# EasyEDA Pro project ProPrj_辉光管时钟V2.0_2025-10-09.epro, board 电源+控制
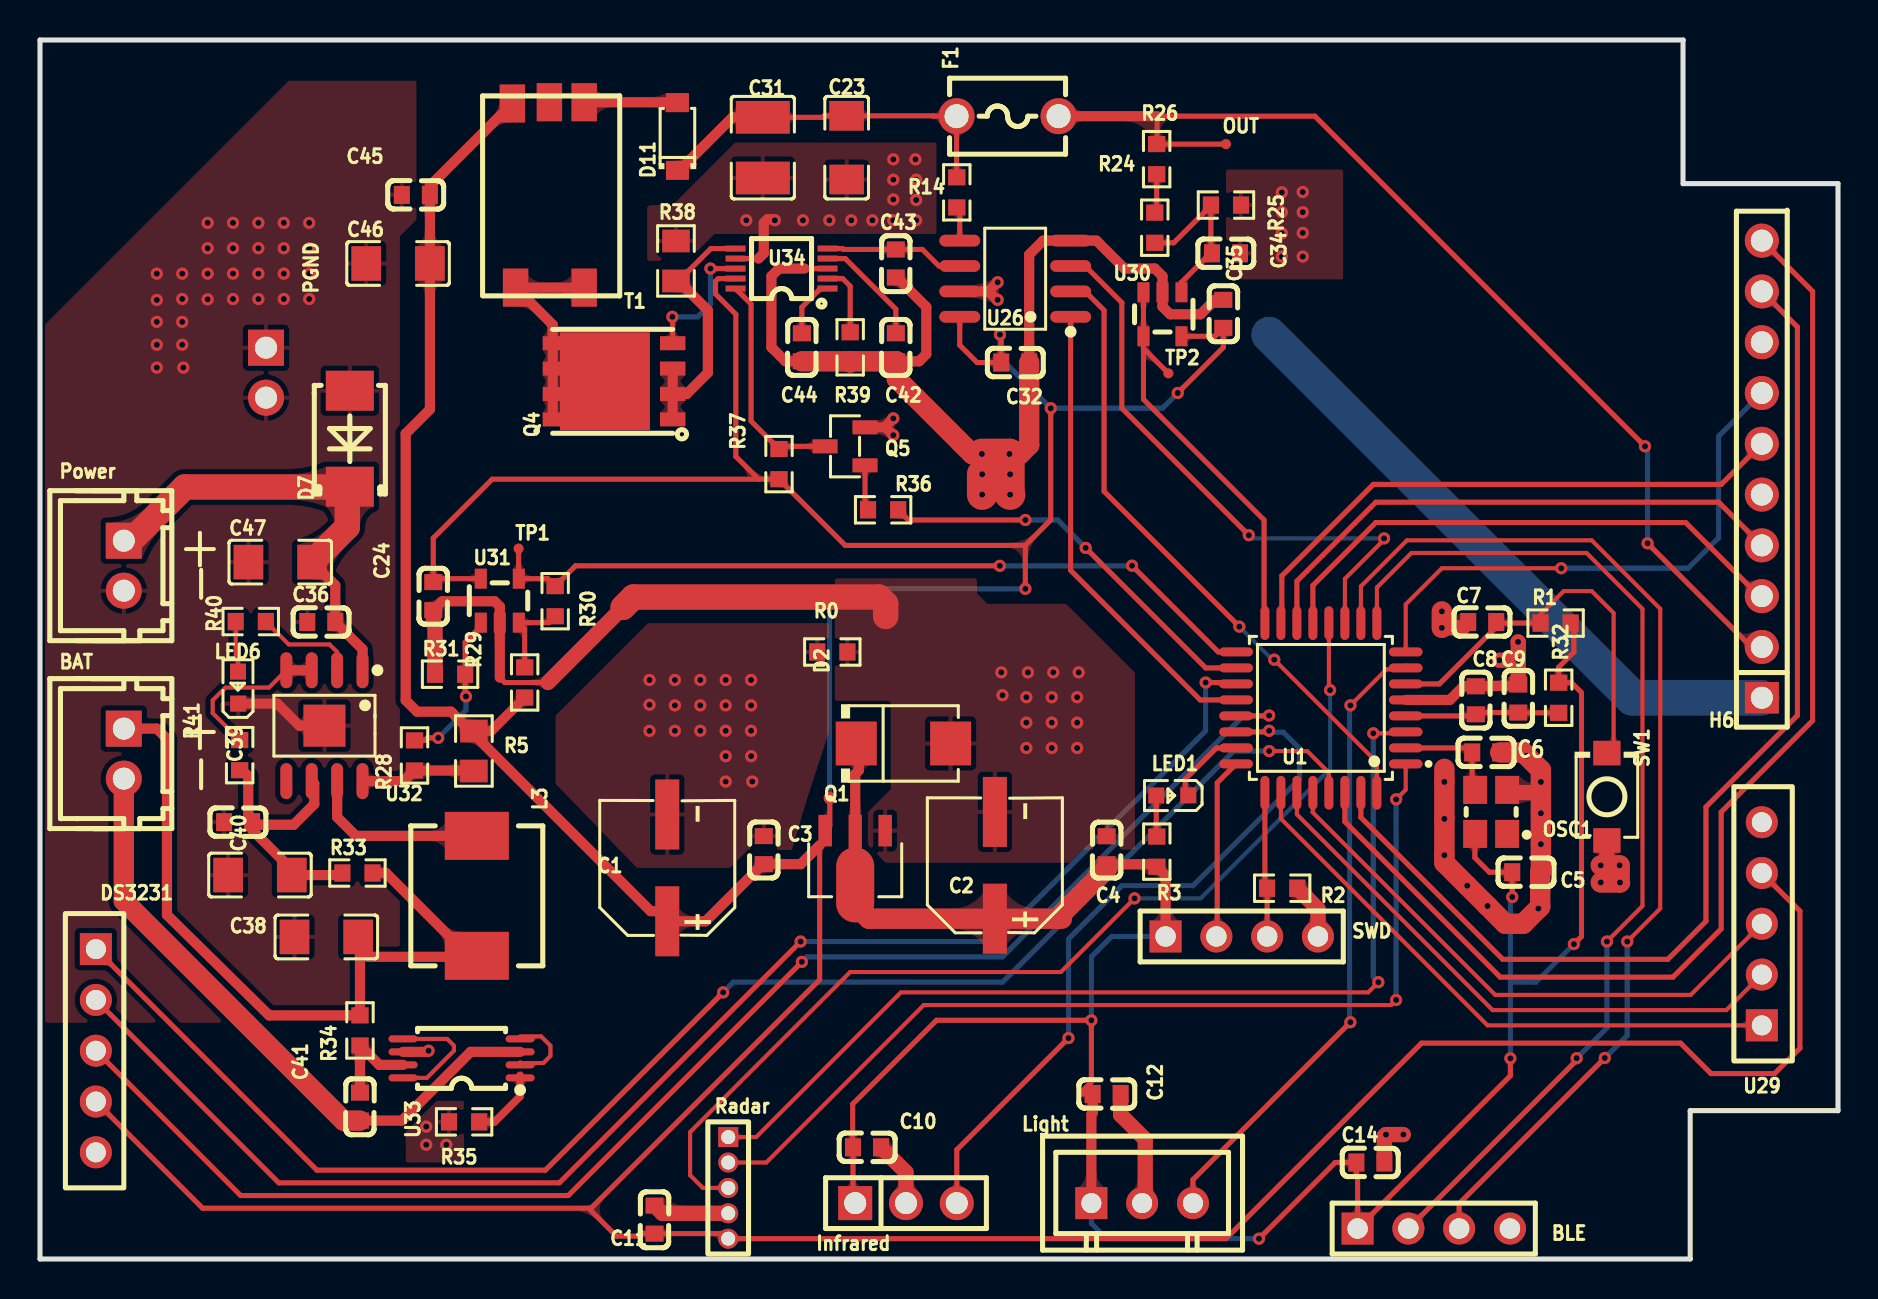
[diagram p3: board, top side]
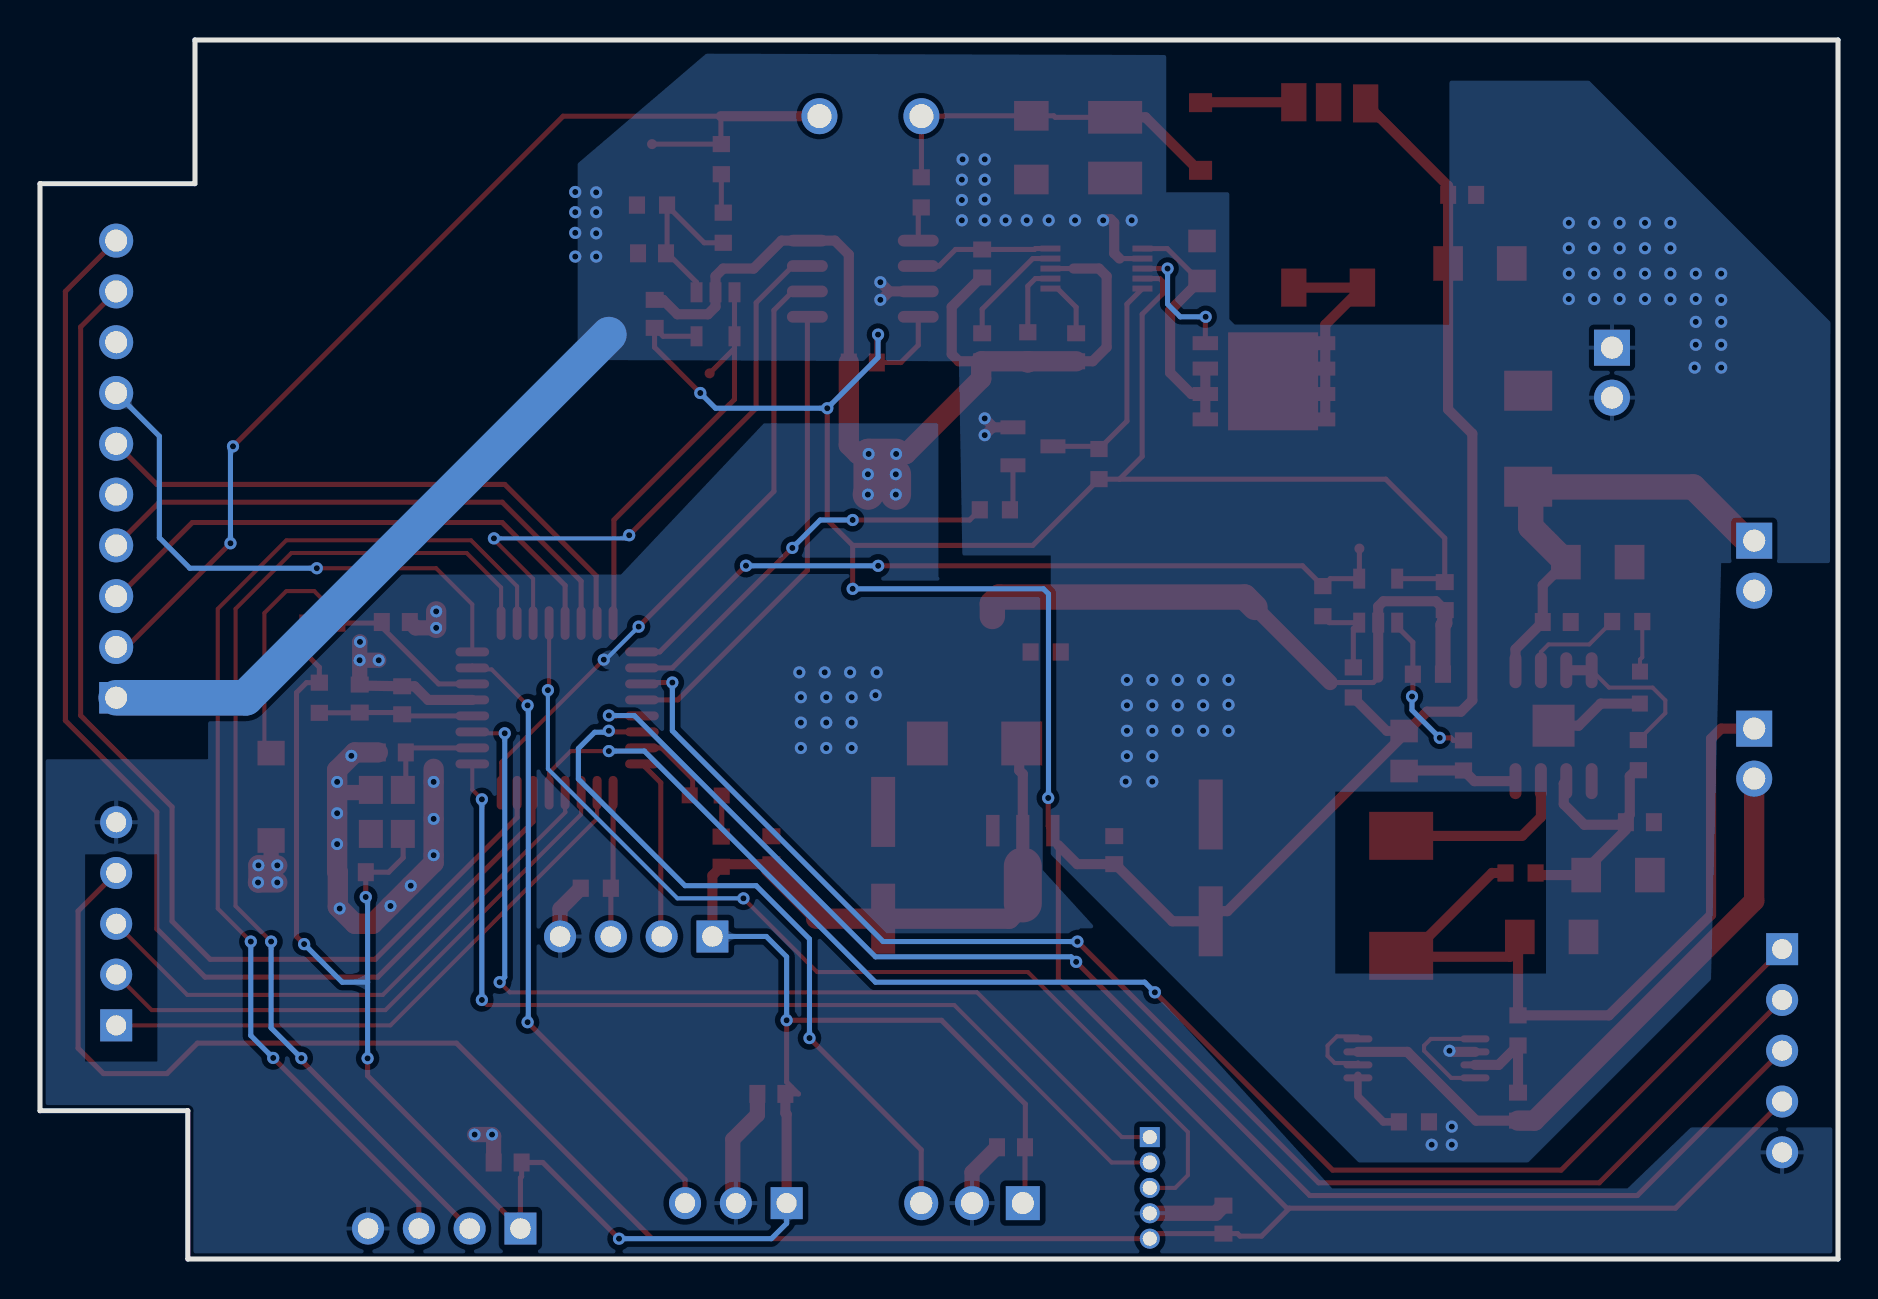
[diagram p4: board, bottom side, seen from below]

Outline 89.92 x 60.96 mm; copper layers: Top Layer, Bottom Layer. Coordinates in mm from the lower left corner of the outline.
Outline path: 0,60.96 0,0 82.52,0 82.52,7.42 89.92,7.42 89.92,53.78 82.17,53.78 82.17,60.96 0,60.96
Stack: Top Layer 0.035mm / Dielectric1 1.51mm FR4 er 4.5 / Bottom Layer 0.035mm

## Design rules (mm)
template: 自定义配置
spacing copperThickness1oz (default): track to track 0.102, other pairs 0.152 to 0.3
spacing copperThickness2oz: track to track 0.203, other pairs 0.152 to 0.3
track width copperThickness1oz (default): min 0.127, default 0.254, max 2.54
track width copperThickness2oz: min 0.203, default 0.254, max 2.54
differential pair differentialPair (default): width min 0.127, default 0.254, max 2.54; gap min 0.152, default 0.152
via viaSize (default): diameter min 0.5, default 0.61, max 10; hole min 0.3, default 0.305, max 6.3

## Placement (name value [footprint] x y rotation side)
BAT  ZX-XH2.54-2PZZ  [CONN-TH_2P-P2.50_HX25003-2A]  4.19 25.27 270 top
BLE  排针  [SIP-2.54MM-4P-CJT-H8.54]  69.7 1.52 180 top
C1  220uF  [CAP-SMD_BD6.3-L6.6-W6.6-FD]  31.37 19.56 90 top
C2  220uF  [CAP-SMD_BD6.3-L6.6-W6.6-FD]  47.75 19.69 90 top
C3  100nF  [C0603]  36.19 20.45 270 top
C4  100nF  [C0603]  53.34 20.44 270 top
C5  100nF  [C0603]  74.32 19.34 0 top
C6  15pF  [C0603]  72.32 25.33 0 top
C7  100nF  [C0603]  72.12 31.85 0 top
C8  100nF  [C0603]  71.81 27.94 270 top
C9  2.2uF  [C0603]  73.93 28.03 270 top
C10  100nF  [C0603]  41.36 5.59 180 top
C11  100nF  [C0603]  30.73 1.97 90 top
C12  100nF  [C0603]  53.34 8.26 180 top
C14  100nF  [C0603]  66.53 4.83 0 top
C23  0.1uF  [c1206]  40.34 55.58 90 top
C24  0.1u  [C0603]  19.67 33.15 90 top
C31  2.2uF  [c1210]  36.15 55.58 90 top
C32  0.1uF  [c0603]  48.77 44.83 180 top
C34  0.1u  [C0603]  59.31 50.29 0 top
C35  0.1u  [C0603]  59.18 47.27 270 top
C36  100nF  [C0603]  14.07 31.85 0 top
C38  22uF  [c1206]  14.32 16.11 0 top
C39  100nF  [C0603]  9.91 21.84 0 top
C40  22uF  [c1206]  11 19.2 0 top
C41  100nF  [C0603]  16 7.62 90 top
C42  0.22uF  [c0603]  42.8 45.59 90 top
C43  10nF  [c0603]  42.8 49.78 90 top
C44  1uF  [c0603]  38.1 45.59 90 top
C45  0.1uF  [c0603]  18.8 53.21 0 top
C46  100uF  [c1206]  17.91 49.78 0 top
C47  100uF  [c1206]  12.02 34.85 0 top
D2  SMBJ3.3A  [SMB_L4.6-W3.6-LS5.3-RD]  43.18 25.78 0 top
D7  SMBJ5.0A  [SMB_L4.4-W3.6-LS5.3-RD]  15.49 41.02 90 top
D11  ES1J  [sod-123_l2.7-w1.6-ls3.6-rd]  31.88 56.13 90 top
DS3231  -  [2.54mm1*5]  2.79 10.42 270 top
F1  JK250-080U  [FUSE-TH_L5.8-W3.8-P5.10-D0.8]  48.39 57.15 0 top
H6  MH254V-11-10-1196  [HDR-TH_10P-P2.54-V-M]  86.11 39.5 90 top
Infrared  PZ254V-11-03P  [HDR-TH_3P-P2.54-V-M]  43.31 2.79 0 top
L3  2.2uH  [IND-SMD_L7.0-W6.6]  21.84 18.16 270 top
LED1  NCD0603R1  [LED0603-RD_RED]  56.62 23.18 180 top
LED6  NCD0603R1  [LED0603-RD_RED]  9.91 28.58 90 top
Light  ZX-XH2.54-3PZZ  [CONN-TH_3P-P2.54_2501S-3P]  55.12 2.79 0 top
OSC1  8MHz  [OSC-SMD_4P-L3.2-W2.5-BL-1]  72.57 22.36 90 top
OUT  -  [Test-Point-0.5mm]  59.31 55.75 0 top
PGND  ZX-XH2.54-2PZZ  [CONN-TH_2P-P2.50_HX25003-2A]  11.3 44.32 270 top
Power  ZX-XH2.54-2PZZ  [CONN-TH_2P-P2.50_HX25003-2A]  4.19 34.67 270 top
Q1  AMS1117-3.3V  [SOT-89-3_L4.5-W2.5-P1.50-LS4.2-BR]  40.77 20.07 90 top
Q4  CSD18540Q5B  [VSON-CLIP-8_L5.0-W6.0-P1.27-BL]  28.64 43.89 90 top
Q5  MMBT5551  [SOT-23-3_L2.9-W1.3-P1.90-LS2.4-BR]  40.26 40.64 0 top
R0  0欧姆  [R0603]  39.62 30.36 0 top
R1  50kΩ  [r0603]  75.79 31.8 0 top
R2  10kΩ  [r0603]  62.12 18.54 180 top
R3  220Ω  [r0603]  55.85 20.37 90 top
R5  100mΩ  [R0805]  21.7 25.4 90 top
R14  910K  [r0603]  45.85 53.34 90 top
R24  1.8MΩ  [r0603]  55.75 51.57 90 top
R25  39kΩ  [r0603]  59.31 52.7 180 top
R26  1MΩ  [r0603]  55.84 55 90 top
R28  1KΩ  [R0603]  18.73 25.18 90 top
R29  10KΩ  [R0603]  24.24 28.83 90 top
R30  10KΩ  [R0603]  25.76 32.9 90 top
R31  30KΩ  [R0603]  20.51 29.25 0 top
R32  0Ω  [R0603]  75.95 28.07 90 top
R33  1Ω  [R0603]  15.88 19.3 0 top
R34  100Ω  [R0603]  16 11.43 90 top
R35  1K  [R0603]  21.21 6.86 0 top
R36  1kΩ  [r0603]  42.16 37.47 0 top
R37  1kΩ  [r0603]  36.96 39.75 270 top
R38  20mΩ  [R0805]  31.81 49.91 270 top
R39  175kΩ  [r0603]  40.52 45.59 270 top
R40  1KΩ  [R0603]  10.54 31.88 180 top
R41  1KΩ  [R0603]  9.98 25.2 90 top
Radar  FH1.27-01-5PZD  [HDR-TH_5P-P1.27-V-M]  34.42 3.56 270 top
SW1  TS-1088R-02026  [SW-SMD_L3.9-W3.0-P4.45]  78.36 23.11 90 top
SWD  排针  [SIP-2.54MM-4P-CJT-H8.54]  60.1 16.13 180 top
T1  -  [TTRN-060-054]  25.53 53.09 180 top
TP1  -  [Test-Point-0.5mm]  23.93 35.53 0 top
TP2  -  [Test-Point-0.5mm]  56.43 44.29 0 top
U1  STM32G070KBT6  [LQFP-32_L7.0-W7.0-P0.80-LS9.0-BL]  64.06 27.56 90 top
U26  MCP41010T-I/SN  [SOIC-8_L4.9-W3.9-P1.27-LS6.0-BL]  48.77 49.02 90 top
U29  -  [2.54mm1*5]  86.11 16.76 90 top
U30  LM321MF  [SOT-23-5_L2.9-W1.6-P0.95-LS2.8-BL]  56.13 47.24 180 top
U31  LM321MF  [SOT-23-5_L2.9-W1.6-P0.95-LS2.8-BL]  22.99 32.92 0 top
U32  IP5306-CK  [SOP-8_L4.9-W3.9-P1.27-LS6.0-BL-EP2.1]  14.22 26.67 180 top
U33  DW03D  [TSSOP-8_L4.4-W3.0-P0.65-LS6.4-BL]  21.08 10.03 90 top
U34  MAX668EUB+  [UMAX-10_L3.0-W3.0-P0.50-LS4.9-BL]  37.08 49.53 90 top

## Footprints (pads in the part's own frame, mm; a bottom-side part is the same pattern mirrored in y, then rotated)
2.54mm1*5
  rect 1.6x1.6 hole 1: 1(-5.08,0)
  round 1.6 hole 1: 2(-2.54,0) 3(0,0) 4(2.54,0) 5(5.08,0)
c0603
  rect 0.8x0.9 smd: 1(-0.7,0) 2(0.7,0)
C0603
  rect 0.8x0.9 smd: 1(-0.7,0) 2(0.7,0)
c1206
  rect 1.485x1.728 smd: 1(-1.593,0) 2(1.593,0)
c1210
  rect 1.635x2.7 smd: 1(-1.518,0) 2(1.518,0)
CAP-SMD_BD6.3-L6.6-W6.6-FD
  rect 3.5x1.2 smd: 1(-2.67,0) 2(2.67,0)
CONN-TH_2P-P2.50_HX25003-2A
  rect 1.8x1.8 hole 1.1: 1(-1.25,0)
  round 1.8 hole 1.1: 2(1.25,0)
CONN-TH_3P-P2.54_2501S-3P
  rect 1.6x1.6 hole 1: 1(-2.54,0)
  round 1.6 hole 1: 2(0,0) 3(2.54,0)
FUSE-TH_L5.8-W3.8-P5.10-D0.8
  round 1.8 hole 1.2: 1(-2.55,0) 2(2.55,0)
HDR-TH_3P-P2.54-V-M
  rect 1.7x1.7 hole 1.1: 1(-2.54,0)
  round 1.7 hole 1.1: 2(0,0) 3(2.54,0)
HDR-TH_5P-P1.27-V-M
  rect 1x1 hole 0.7: 1(-2.54,0)
  round 1 hole 0.7: 2(-1.27,0) 3(0,0) 4(1.27,0) 5(2.54,0)
HDR-TH_10P-P2.54-V-M
  rect 1.575x1.7 hole 1.1: 1(-11.43,0)
  round 1.7 hole 1.1: 2(-8.89,0) 3(-6.35,0) 4(-3.81,0) 5(-1.27,0) 6(1.27,0) 7(3.81,0) 8(6.35,0) 9(8.89,0) 10(11.43,0)
IND-SMD_L7.0-W6.6
  rect 2.4x3.2 smd: 1(-3,0) 2(3,0)
LED0603-RD_RED
  rect 0.8x0.8 smd: 1(-0.799,-0.004) 2(0.799,0.004)
LQFP-32_L7.0-W7.0-P0.80-LS9.0-BL
  oval 0.448x1.684 smd: 1(-2.8,-4.242) 2(-2,-4.242) 3(-1.2,-4.242) 4(-0.4,-4.242) 5(0.4,-4.242) 6(1.2,-4.242) 7(2,-4.242) 8(2.8,-4.242) 17(2.8,4.242) 18(2,4.242) 19(1.2,4.242) 20(0.4,4.242) 21(-0.4,4.242) 22(-1.2,4.242) 23(-2,4.242) 24(-2.8,4.242)
  oval 1.684x0.448 smd: 9(4.242,-2.8) 10(4.242,-2) 11(4.242,-1.2) 12(4.242,-0.4) 13(4.242,0.4) 14(4.242,1.2) 15(4.242,2) 16(4.242,2.8) 25(-4.242,2.8) 26(-4.242,2) 27(-4.242,1.2) 28(-4.242,0.4) 29(-4.242,-0.4) 30(-4.242,-1.2) 31(-4.242,-2) 32(-4.242,-2.8)
OSC-SMD_4P-L3.2-W2.5-BL-1
  rect 1.4x1.2 smd: 1(-1.1,-0.8) 2(1.1,-0.8) 3(1.1,0.8) 4(-1.1,0.8)
r0603
  rect 0.806x0.864 smd: 1(-0.753,0) 2(0.753,0)
R0603
  rect 0.806x0.864 smd: 1(-0.753,0) 2(0.753,0)
R0805
  rect 1.133x1.377 smd: 1(-1,0) 2(1,0)
SIP-2.54MM-4P-CJT-H8.54
  rect 1.6x1.6 hole 1.02: 1(3.81,0)
  round 1.6 hole 1.02: 2(1.27,0) 3(-1.27,0) 4(-3.81,0)
SMB_L4.4-W3.6-LS5.3-RD
  rect 2x2.4 smd: 1(-2.4,0) 2(2.4,0)
SMB_L4.6-W3.6-LS5.3-RD
  rect 2.047x2.192 smd: 1(-2.361,0) 2(2.361,0)
sod-123_l2.7-w1.6-ls3.6-rd
  rect 0.95x1.15 smd: 1(-1.692,0) 2(1.692,0)
SOIC-8_L4.9-W3.9-P1.27-LS6.0-BL
  oval 0.588x2.045 smd: 1(-1.905,-2.772) 2(-0.635,-2.772) 3(0.635,-2.772) 4(1.905,-2.772) 5(1.905,2.772) 6(0.635,2.772) 7(-0.635,2.772) 8(-1.905,2.772)
SOP-8_L4.9-W3.9-P1.27-LS6.0-BL-EP2.1
  oval 0.6x1.8 smd: 1(-1.905,-2.772) 2(-0.635,-2.772) 3(0.635,-2.772) 4(1.905,-2.772) 5(1.905,2.772) 6(0.635,2.772) 7(-0.635,2.772) 8(-1.905,2.772)
  rect 2.1x2.1 smd: 9(0,0)
SOT-23-3_L2.9-W1.3-P1.90-LS2.4-BR
  rect 1.25x0.7 smd: 1(1,-0.95) 2(1,0.95) 3(-1,0)
SOT-23-5_L2.9-W1.6-P0.95-LS2.8-BL
  rect 0.6x1 smd: 1(-0.95,-1.1) 2(0,-1.1) 3(0.95,-1.1) 4(0.95,1.1) 5(-0.95,1.1)
SOT-89-3_L4.5-W2.5-P1.50-LS4.2-BR
  rect 1.575x0.672 smd: 1(1.356,-1.5) 3(1.356,1.5)
  custom 5.377x1.9 smd: 2(-1.356,0)
SW-SMD_L3.9-W3.0-P4.45
  rect 1.23x1.36 smd: 1(-2.185,0) 2(2.185,0)
Test-Point-0.5mm
  round 0.5 smd: 1(0,0)
TSSOP-8_L4.4-W3.0-P0.65-LS6.4-BL
  oval 0.353x1.454 smd: 1(-0.975,-2.927) 2(-0.325,-2.927) 3(0.325,-2.927) 4(0.975,-2.927) 5(0.975,2.927) 6(0.325,2.927) 7(-0.325,2.927) 8(-0.975,2.927)
TTRN-060-054
  custom 1.27x1.905 smd: 1(1.905,-4.699) 2(-1.687,4.51) 3(-1.687,-4.761) 4(1.742,4.51) NC(0.051,-4.761)
UMAX-10_L3.0-W3.0-P0.50-LS4.9-BL
  rect 0.3x1 smd: 1(-0.999,-2.3) 2(-0.499,-2.3) 3(0.001,-2.3) 4(0.501,-2.3) 5(1.001,-2.3) 6(0.999,2.3) 7(0.499,2.3) 8(-0.001,2.3) 9(-0.5,2.3) 10(-1.001,2.3)
VSON-CLIP-8_L5.0-W6.0-P1.27-BL
  rect 0.7x1.27 smd: 1(-1.904,-3) 2(-0.636,-3) 3(0.636,-3) 4(1.906,-3)
  rect 0.7x1 smd: 5(1.904,3) 6(0.634,3) 7(-0.636,3) 8(-1.906,3)
  rect 4.9x4.5 smd: 8(-0.001,0.39)

## Nets
As in the schematic, except:
POWER: R36.2 U1.18

Pads without a net: H6 5 8; OSC1 1; T1 NC; U32 5

## Via types
v1: diameter 0.61, hole 0.305, Top Layer to Bottom Layer, 165 vias

## Routing (per net, layer and track width the routed paths; a pad name or vN(x,y) marks a point on that pad's centre or on a via; arc(x,y) is an arc through that point)
170V: length 53.8
  Top Layer w0.254: H6.2 85.58,30.61 v1(80.39,35.79) ; v1(80.26,40.64) 63.75,57.15 55.86,57.15 55.86,55.78 R26.2 55.85,55.75 OUT.1
  Top Layer w0.508: F1.2 55.86,57.15
  Bottom Layer w0.254: v1(80.26,40.64) 80.39,40.51 v1(80.39,35.79)
+3.3V: length 129.5
  Top Layer w0.254: Infrared.1 40.66,2.9 C10.2 40.64,5.61 40.64,7.75 44.83,11.94 v1(52.58,11.94) 52.58,8.85 51.99,8.26 C12.2 ; OSC1.4 71.75,21.24 71.75,20.07 72.48,19.34 C5.1 73.63,19.34 v1(73.63,18.1) ; v1(73.53,10.03) 73.53,9.17 BLE.1 65.89,4.06 65.83,4.12 C14.1 64.77,4.83 v1(60.96,1.02) ; R1.2 76.71,31.64 76.71,30.35 75.95,29.59 R32.2 76.59,28.82 77.09,28.32 77.09,16.13 v1(76.71,15.75)
  Top Layer w0.508: Q1.2 40.77,24.25 40.95,24.43 40.95,25.78 ; SWD.1 56.29,19.18 55.73,19.74 C4.2 ; C12.2 52.64,7.3 52.58,7.23 Light.1
  Top Layer w1.016: 40.38,18.09 41.45,17.02 C2.1 50.85,17.02 ; 50.85,17.02 53.39,19.56 ; 50.85,17.02 51.1,17.02
  Bottom Layer w0.254: Light.1 52.58,1.78 53.34,1.02 v1(60.96,1.02) ; SWD.1 53.59,16.13 52.58,15.11 v1(52.58,11.94) ; v1(73.53,10.03) 73.53,13.84 ; 73.53,13.84 74.8,13.84 v1(76.71,15.75) ; 73.53,13.84 73.53,18.01 v1(73.63,18.1)
+5V: length 291.3
  Top Layer w0.254: 59.13,46.52 59.18,46.52 59.18,45.59 v1(56.9,43.31) ; 59.13,46.52 C35.2 ; 59.13,46.52 58.76,46.14 U30.5 ; 35.93,39 R37.2 40.27,35.69 49.28,35.69 ; 35.93,39 22.61,39 19.67,36.05 C24.2 19.84,34.02 U31.5 ; 35.93,39 34.8,40.13 34.8,47.24 33.78,48.26 33.78,48.9 33.92,49.03 U34.9 ; 27.43,2.54 27.56,2.54 38.99,13.97 38.99,20.69 ; 27.43,2.54 8.13,2.54 DS3231.4 ; 27.43,2.54 28.83,1.14 29.9,1.14 30.03,1.27 C11.1 34.16,1.27 Radar.5 59.31,1.02 69.09,10.8 82.04,10.8 83.57,9.27 86.74,9.27 88.01,10.54 88.01,17.4 86.11,19.3 ; 49.28,35.69 50.55,36.96 v1(50.55,42.55) ; 49.28,35.69 v1(49.28,33.51) ; v1(48.01,46.23) 48.07,46.17 C32.2 46.86,44.83 46,45.7 U26.8 ; v1(39.5,23.06) 39.5,21.65 Q1.3
  Top Layer w0.482: R29.1 22.56,26.4 R5.2
  Top Layer w0.508: 38.99,20.69 38.04,19.75 C3.2 36.15,19.75 33.29,16.89 C1.1 30.86,17.4 30.53,17.4 20.56,27.37 18.86,27.37 18.29,27.94 18.29,41.28 19.5,42.49 C46.2 19.5,53.66 T1.1
  Bottom Layer w0.254: v1(49.28,33.51) 39.74,33.51 39.48,33.26 39.48,23.07 v1(39.5,23.06) ; v1(56.9,43.31) 56.13,42.55 v1(50.55,42.55) 48.01,45.09 v1(48.01,46.23)
GND: length 142.8
  Top Layer w0.254: 25.4,28.83 23.24,28.83 22.99,29.08 ; 38.23,49.53 U34.3
  Top Layer w0.508: C24.1 20.11,32.89 22.73,32.89 22.99,32.63 U31.2 22.99,29.08 ; C32.1 49.47,50.23 50.17,50.93 U26.4 52.83,50.93 54.23,49.53 55.75,49.53 56.13,49.15 U30.2 56.13,47.62 56.52,47.24 58.04,47.24 58.76,47.97 C35.1 ; 38.23,49.53 36.96,49.53 36.58,49.15 36.58,45.59 37.28,44.89 C44.1 ; C43.1 42.85,49.08 44.32,47.61 44.32,45.25 43.96,44.89 C42.1 ; U1.5 70.5,27.96 71.19,28.64 C8.1 73.93,28.68
  Top Layer w0.762: C12.1 54.04,7.21 55.27,5.98 55.27,2.9 ; C7.1 71.13,31.56 v1(70.1,31.56) ; 75.06,23.33 73.37,23.33 ; C9.1 73.93,29.94 ; 73.93,29.94 v1(73.93,29.94) ; 73.93,29.94 73.93,30.85 v1(73.91,30.86) ; 73.93,29.94 v1(72.98,29.94) ; R31.1 19.75,31.71 19.67,31.8 C24.1 ; v1(78.05,19.69) 78.36,19.99 SW1.1 ; R2.1 63.91,17.51 SWD.4 ; 25.4,28.83 29.16,32.59 ; Infrared.2 43.31,4.34 C10.1 ; v1(68.18,6.22) v1(67.31,6.22) 67.23,6.14 C14.2 ; Radar.4 31.12,2.29 30.73,2.67
  Top Layer w1.016: v1(47.12,39.24) 47.12,40.24 v1(47.1,40.26) 46.61,40.26 42.85,44.02 42.85,44.89 ; v1(70.1,32.39) v1(70.1,31.56) ; C42.1 40.57,44.89 R39.2 40.46,44.89 C44.1 ; v1(78.05,19.69) v1(78.99,19.69) 78.99,18.85 v1(79.01,18.83) v1(78.05,18.83) ; C6.2 74.18,25.33 75.06,24.45 v1(75.06,23.86) v1(75.06,22.29) v1(75.06,20.75) 75.06,19.38 75.02,19.34 75.02,17.62 v1(74.93,17.53) 74.17,16.76 73.28,16.76 v1(72.39,17.65) v1(71.37,18.67) 70.23,19.81 v1(70.23,20.19) v1(70.23,22.01) v1(70.23,23.86) 70.23,24.51 ; v1(48.48,40.26) 49.02,40.26 49.47,40.7 C32.1
  Top Layer w1.27: 42.29,32.13 42.29,32.77 41.95,33.11 29.68,33.11 29.16,32.59
  Top Layer w1.524: v1(47.12,39.24) v1(47.12,38.23) ; v1(48.51,38.23) 48.48,38.26 v1(48.48,40.26) v1(47.1,40.26)
  vias: v1(48.07,29.34) v1(48.13,28.19) v1(48.51,39.24) v1(49.33,28.09) v1(49.33,26.82) v1(49.33,25.55) v1(49.4,29.34) v1(50.6,28.09) v1(50.6,26.82) v1(50.6,25.55) v1(50.67,29.34) v1(51.94,29.34) v1(51.87,28.09) v1(51.87,26.82) v1(51.87,25.55) v1(74.35,25.16)
PGND: length 46.9
  Top Layer w0.254: U34.7 35.93,50.03
  Top Layer w0.508: 47.43,48.39 v1(47.89,48.85) ; 47.43,48.39 U26.7 ; 47.43,48.39 47.85,47.97 v1(47.89,47.97) ; 42.22,41.59 42.28,41.59 v1(42.67,41.2) ; 42.22,41.59 Q5.2 ; 42.22,41.59 v1(42.67,42.04) ; U33.6 19.38,10.36 v1(19.43,10.41) ; U32.9 12.97,26.67 11.87,27.78 LED6.1 ; v1(36.75,51.94) 36.7,52 36.37,52 36.19,51.82 36.19,50.29 35.93,50.03
  Bottom Layer w1.778: 61.47,46.23 79.63,28.07 H6.1
  vias: v1(5.84,49.28) v1(5.84,47.96) v1(5.84,46.86) v1(5.84,45.72) v1(5.84,44.58) v1(7.11,49.28) v1(7.11,48.01) v1(7.11,46.86) v1(7.11,45.72) v1(7.17,44.58) v1(8.38,51.82) v1(8.38,50.55) v1(8.38,49.28) v1(8.38,47.99) v1(9.65,51.82) v1(9.65,50.55) v1(9.65,49.28) v1(9.65,48.01) v1(10.92,51.82) v1(10.92,50.55) v1(10.92,49.28) v1(10.92,48.01) v1(12.19,51.82) v1(12.19,50.55) v1(12.19,49.28) v1(12.19,48.01) v1(13.46,51.82) v1(13.46,50.55) v1(13.46,49.28) v1(13.46,48.01) v1(19.31,6.62) v1(19.31,5.72) v1(20.32,5.72) v1(30.48,28.96) v1(30.48,27.72) v1(30.48,26.41) v1(31.75,28.96) v1(31.75,27.69) v1(31.75,26.42) v1(33.02,28.96) v1(33.02,27.69) v1(33.02,26.42) v1(34.29,28.96) v1(34.29,27.69) v1(34.29,26.42) v1(34.29,25.15) v1(34.29,23.88) v1(35.32,51.94) v1(35.56,28.96) v1(35.56,27.69) v1(35.56,26.42) v1(35.56,25.15) v1(35.62,23.88) v1(38.15,51.94) v1(39.47,51.94) v1(40.57,51.94) v1(41.63,51.94) v1(42.67,54.99) v1(42.67,53.98) v1(42.67,52.98) v1(42.67,51.94) v1(43.78,54.99) v1(43.81,53.98) v1(43.81,52.96) v1(43.81,51.94) v1(62.1,53.34) v1(62.1,52.35) v1(62.1,51.29) v1(62.1,50.13) v1(63.15,53.36) v1(63.15,52.35) v1(63.15,51.32) v1(63.15,50.13)
VBUS: length 5.8
  Top Layer w0.508: U32.8 18.18,23.9 18.71,24.43 21.63,24.43 21.71,24.51
VIN: length 23.3
  Top Layer w0.508: C47.2 14.77,33.69 C36.2 16.13,30.49 U32.1
  Top Layer w1.27: 14.7,38.59 14.73,38.62 ; 14.7,38.59 14.7,38.58 ; 14.7,38.59 14.7,38.61 14.47,38.61 ; 14.47,38.61 7.24,38.61 4.55,35.92 Power.1 ; 14.47,38.61 15.37,38.35 15.37,36.61 C47.2
BATTERY: length 39.2
  Top Layer w0.508: L3.2 21.44,15.16 17.3,19.3 R33.2 ; 16,15.51 R34.2 11.46,12.18 6.35,17.21 6.35,26.02 5.84,26.52 BAT.1 ; 16,15.51 16.4,15.11 21.16,15.11 21.21,15.16 ; 16,15.51 15.79,15.72 15.79,16.11
BLE_RX: length 54.3
  Top Layer w0.203: v1(79.38,15.88) 81.03,17.53 81.03,32.51 77.6,35.94 68.36,35.94 66.06,33.64 U1.10
  Top Layer w0.254: v1(78.25,10.05) 70.97,2.77 BLE.3
  Bottom Layer w0.254: v1(79.38,15.88) 79.38,11.18 v1(78.25,10.05)
BLE_TX: length 52.8
  Top Layer w0.203: 66.86,31.8 66.86,33.58 68.58,35.31 77.34,35.31 80.14,32.51 80.14,17.65 v1(78.36,15.88)
  Top Layer w0.254: BLE.2 76.85,9.94 v1(76.85,10.04)
  Bottom Layer w0.254: v1(76.85,10.04) 78.36,11.56 v1(78.36,15.88)
CLK: length 28.7
  Top Layer w0.203: U29.3 82.55,13.21 72.77,13.21 63.63,22.35 ; U1.28 63.66,22.35
CS: length 29.1
  Top Layer w0.203: 62.86,23.32 62.86,22.23 72.64,12.45 84.33,12.45 U29.2
CURRENT_IN_ADC: length 39.7
  Top Layer w0.254: TP1.1 23.93,34.03 U31.4 25.39,34.02 R30.2 26.78,34.67 v1(48,34.67) ; v1(54.61,34.67) 58.92,30.36 U1.17
  Bottom Layer w0.254: v1(48,34.67) 54.6,34.67 v1(54.61,34.67)
DS3231: length 76.4
  Top Layer w0.203: U1.29 64.46,24.32 63.37,25.4 v1(61.47,25.4)
  Top Layer w0.254: v1(34.16,13.34) 25.27,4.45 13.84,4.45 DS3231.1
  Bottom Layer w0.254: v1(34.16,13.34) 34.67,13.84 48.13,13.84 59.69,25.4 v1(61.47,25.4)
I2C1_SCL: length 72.6
  Top Layer w0.254: v1(58.29,28.83) 59.74,28.83 U1.19 ; v1(38.04,15.88) 25.97,3.81 11.94,3.81 DS3231.2
  Bottom Layer w0.254: v1(38.04,15.88) 47.75,15.88 58.29,26.42 v1(58.29,28.83)
I2C1_SDA: length 73.3
  Top Layer w0.254: U1.21 61.45,27.16 v1(61.47,27.18) ; v1(38.1,14.86) 26.42,3.18 10.03,3.18 DS3231.3
  Bottom Layer w0.254: v1(61.47,27.18) 60.2,27.18 48.13,15.11 38.35,15.11 v1(38.1,14.86)
INFRARED-RAY: length 35.5
  Top Layer w0.254: U1.22 61.41,26.36 v1(61.47,26.42) ; Infrared.3 45.85,5.46 v1(51.44,11.05)
  Bottom Layer w0.254: v1(61.47,26.42) 61.54,26.34 62.18,26.34 62.99,25.53 62.99,24 57.66,18.67 54.1,18.67 51.44,16 v1(51.44,11.05)
LED: length 4.1
  Top Layer w0.254: U1.23 58.83,25.56 57.28,24 57.28,23.33 LED1.1
LIGHT_ADC: length 31.9
  Top Layer w0.203: 68.3,29.69 68.09,29.48 67.33,29.48 v1(65.53,27.69)
  Top Layer w0.254: v1(65.53,11.84) 57.66,3.97 57.66,2.79
  Bottom Layer w0.254: v1(65.53,11.84) 65.5,11.81 65.5,27.65 v1(65.53,27.69)
MOSI: length 29.6
  Top Layer w0.203: 86.11,11.68 72.39,11.68 62.06,22.02 U1.26
NRST: length 20
  Top Layer w0.203: R1.1 75.04,32.24 76.2,33.4 77.6,33.4 78.69,32.3 78.69,25.63 SW1.2
  Top Layer w0.254: C7.2 72.88,31.8 74.91,31.8 ; 72.82,31.6 69.98,28.76 U1.6
OSC_IN: length 5.6
  Top Layer w0.254: U1.2 71.4,25.56 C6.1 71.62,23.61 OSC1.3 71.77,23.33 71.7,23.4
POWER: length 20.2
  Top Layer w0.254: v1(52.29,35.56) 58.29,29.56 U1.18 ; R36.2 43.43,36.96 v1(49.28,36.96)
  Bottom Layer w0.254: v1(52.29,35.56) 50.9,36.96 v1(49.28,36.96)
RADER: length 49.9
  Top Layer w0.203: v1(66.68,26.29) 68.23,26.29 U1.3 ; v1(66.93,13.84) 66.42,13.34 43.05,13.34 35.81,6.1 Radar.1
  Bottom Layer w0.254: v1(66.68,26.29) 66.68,14.1 v1(66.93,13.84)
RADER_RX: length 48.5
  Top Layer w0.203: v1(67.82,12.95) 67.56,12.7 44.2,12.7 36.32,4.83 34.42,4.83 ; v1(67.82,22.99) 68.3,23.47 U1.1
  Bottom Layer w0.254: 67.84,22.76 67.82,22.73 v1(67.82,12.95)
RADER_TX: length 51.2
  Top Layer w0.203: U1.12 64.46,28.51 v1(64.52,28.45) ; v1(54.74,18.03) 51.05,14.35 40.51,14.35 32.51,6.35 32.51,4.19 33.15,3.56 Radar.3
  Bottom Layer w0.203: v1(64.52,28.45) 64.52,24.51 58.04,18.03 v1(54.74,18.03)
SPI_CS: length 23.6
  Top Layer w0.254: U1.20 58.02,27.96 51.54,34.44 U26.1
SPI_MOSI: length 29.5
  Top Layer w0.203: U1.11 65.26,34.01 67.22,35.97 v1(67.22,36.04)
  Top Layer w0.254: U26.3 52.27,49.66 54.1,47.82 54.1,42.55 v1(60.45,36.2)
  Bottom Layer w0.203: v1(67.22,36.04) 60.61,36.04 v1(60.45,36.2)
SPI_SCK: length 31.9
  Top Layer w0.203: 66.86,23.32 66.86,24.84 v1(61.72,29.97)
  Top Layer w0.254: v1(59.98,31.62) 53.21,38.39 53.21,47.44 52.27,48.39 U26.2
  Bottom Layer w0.203: v1(59.98,31.62) 61.63,29.97 v1(61.72,29.97)
SWCLK: length 7.2
  Top Layer w0.254: SWD.3 61.37,18.54 61.26,18.65 U1.25
SWDIO: length 8.9
  Top Layer w0.254: U1.24 58.87,23.82 58.87,16.26
SWITCH1: length 27.2
  Top Layer w0.254: H6.3 85.98,33.15 82.3,36.83 66.8,36.83 63.66,33.68 U1.13
SWITCH2: length 27.9
  Top Layer w0.254: H6.4 83.95,37.85 66.8,37.85 62.86,33.9 62.86,31.8
SWITCH3: length 29.1
  Top Layer w0.254: U1.15 62.1,31.85 62.1,34.16 66.68,38.73 84.07,38.73 H6.6
SWITCH4: length 27.5
  Top Layer w0.203: U1.8 68.3,32.74 70.1,34.54 v1(76.07,34.54)
  Bottom Layer w0.254: H6.7 83.95,41.15 83.95,36.07 82.42,34.54 v1(76.07,34.54)
SWITCH5: length 56.3
  Top Layer w0.254: U1.31 66.06,22.08 73.15,14.99 81.41,14.99 83.31,16.89 83.31,22.61 87.88,27.18 87.88,46.61 H6.9
SWITCH6: length 61.8
  Top Layer w0.254: U1.30 65.26,21.87 73.03,14.1 81.66,14.1 84.07,16.51 84.07,22.35 88.65,26.92 88.65,48.39 H6.10
VOLTAGE_OUT_ADC: length 20.8
  Top Layer w0.254: 55.18,45.54 55.18,48.34 ; 55.18,45.54 TP2.1 ; 55.18,45.54 55.18,42.99 61.21,36.96 61.21,31.84 U1.16
$1N3438: length 2.1
  Top Layer w0.254: R3.2 55.83,21.15 LED1.2
$1N9499: length 7.7
  Top Layer w0.254: R32.1 73.94,27.31 C9.2 71.89,27.33 C8.2 71.72,27.16 U1.4
$3N2637: length 18.2
  Top Layer w0.254: R14.2 45.84,54.1 F1.1 44.68,57.15 44.66,57.17 C23.2 39.22,57.17 39.15,57.09 36.15,57.09
  Top Layer w0.508: 36.15,57.09 34.63,57.09 31.98,54.44 D11.1
$3N2640: length 1.7
  Top Layer w0.254: R14.1 46,52.44 U26.5
$3N11326: length 2
  Top Layer w0.254: R24.2 55.84,52.42 55.84,54.25
$3N12856: length 8.5
  Top Layer w0.254: R24.1 56.7,50.82 58.56,52.68 ; 58.56,52.68 58.56,50.37 58.48,50.29 58.48,50.24 57.08,48.84 U30.1 ; 58.56,52.68 R25.2
$3N14639: length 4.3
  Top Layer w0.254: R30.1 25.44,31.82 U31.3 24.24,31.53 R29.2
$3N14774: length 8
  Top Layer w0.254: U31.1 22.04,31.62 21.26,30.84 R31.2 21.26,28.07 ; v1(19.92,26.06) 19.37,26.06 19.24,25.94 R28.2
  Bottom Layer w0.254: v1(19.92,26.06) 21.3,27.45 v1(21.3,28.13)
$3N19545: length 8.5
  Top Layer w0.508: U32.7 14.86,22.1 15.8,21.16 21.21,21.16
$3N19735: length 3.9
  Top Layer w0.203: 24.01,11.14 25.06,11.14 25.53,10.67 25.53,10.16 25.17,9.8 24.04,9.8 24.01,9.84
$3N19736: length 31.9
  Top Layer w0.508: U33.3 21.53,10.36 18.1,6.92 C41.1
  Top Layer w1.016: BAT.2 4.19,17.91 15.18,6.92 C41.1
$3N19737: length 6
  Top Layer w0.203: U33.5 20.36,11.01 20.7,10.67 20.7,10.41 19.35,9.06 U33.8
$3N19739: length 4.9
  Top Layer w0.508: C41.2 R34.1 16.97,9.71 U33.7
$3N19740: length 3.5
  Top Layer w0.381: 24.01,8.26 24.01,9.19 ; R35.2 22.73,6.86 24.01,8.13
$3N23149: length 2.3
  Top Layer w0.254: R36.1 41.26,37.62 Q5.1
$3N23156: length 11.3
  Top Layer w0.254: U34.10 35.56,47.75 35.56,41.9 R37.1 37.09,40.64 Q5.3
$3N23384: length 5.7
  Top Layer w0.254: U34.4 40.27,50.03 42.8,47.5 C42.2
$3N23532: length 3.6
  Top Layer w0.254: R39.1 40.52,48.65 40.14,49.03 U34.2
$3N23544: length 3
  Top Layer w0.254: U34.1 39.03,48.53 38.1,47.6 C44.2
$3N23743: length 13.6
  Top Layer w0.254: U34.6 33.55,50.53 31.93,48.91
  Top Layer w0.508: R38.2 31.93,48.91 33.4,47.44 33.4,44.32 32.33,43.26 Q4.2 ; Q4.3 Q4.2 ; Q4.2 Q4.1
$3N23755: length 6.5
  Top Layer w0.254: v1(31.62,47.12) 31.64,47.1 Q4.4 ; U34.8 33.53,49.53
  Bottom Layer w0.254: v1(33.53,49.53) 33.53,47.75 32.89,47.12 v1(31.62,47.12)
$3N23799: length 10.8
  Top Layer w0.508: Q4.8 Q4.7 Q4.6 Q4.5 25.64,46.72 T1.4 T1.2
$3N23862: length 4.7
  Top Layer w0.508: T1.3 31.86,57.85 D11.2
$3N23904: length 6.5
  Top Layer w0.254: 45.55,49.66 44.96,49.66 44.13,50.48 C43.2 40.18,50.48 40.14,50.53 U34.5
$3N25392: length 5.1
  Top Layer w0.203: U32.2 14.86,30.35 14.48,30.73 12.44,30.73 R40.1
$3N25397: length 2.6
  Top Layer w0.203: R40.2 9.79,30.09 9.9,29.98 LED6.2
$3N25796: length 13.3
  Top Layer w0.508: R33.1 15.02,19.2 C40.2 12.59,19.48 10.61,21.46 ; R41.1 10.11,24.45 10.41,24.14 10.41,22.23 10.92,21.72 12.69,21.72 13.72,22.75 13.72,23.77 U32.6
$3N27137: length 8.1
  Top Layer w0.203: U32.4 11.45,28.58 9.27,28.58 8.64,27.94 8.64,27.3 R41.2
  Top Layer w0.508: U32.4 U32.3

## Copper pours and planes (outline as drawn; the poured copper is in the pictures)
GND on Top Layer: 39.75,34.04 39.75,27.91 42.45,27.91 42.55,27.81 42.55,23.5 41.4,22.35 41.4,20.7 42.29,19.81 51.5,19.81 52.16,20.47 54.76,20.47 54.76,29.32 51.31,32.77 47.37,32.77 46.86,33.27 46.86,34.04
GND on Bottom Layer: 77.39,34.25 81.53,29.34 81.53,25.02 91.82,25.02 91.82,-1.91 -2.29,-1.91 -2.41,-2.03 -2.41,6.62 7.37,6.6 10.54,3.56 25.28,3.56 39.75,19.47 39.75,34.13 44.96,34.13 44.96,41.82 53.72,41.82 60.87,34.25
PGND on Top Layer: 18.82,58.93 18.82,51.97 18,51.14 18,11.81 -1.28,11.81 -1.39,45.09 12.45,58.93
PGND on Top Layer: 18.29,6.36 18.29,4.83 21.21,4.83 21.21,7.91 19.83,7.91
PGND on Top Layer: 59.31,54.48 59.31,48.99 65.17,48.99 65.17,54.46 65.15,54.48
PGND on Top Layer: 34.77,55.83 44.83,55.83 44.83,51.26 33.73,51.26 32.38,49.91 30.36,49.91 30.36,52.59 30.48,52.7 31.65,52.7
PGND on Top Layer: 25.78,23.76 29.86,19.56 34.51,19.56 35.36,20.42 35.36,20.45 37.6,20.45 38.35,22.99 39.48,26.43 39.48,31.8 30.41,31.8 25.78,27.18
PGND on Bottom Layer: 39.37,20.23 23.97,4.83 15.49,4.83 6.35,13.97 5.84,34.8 0.4,34.8 0.38,46.86 12.45,58.93 19.43,58.93 19.43,46.74 30.17,46.74 30.44,47 30.44,53.35 33.59,53.35 33.59,60.21 56.6,60.28 63.03,54.78 63.03,44.96 43.96,44.89 43.79,35.18 39.37,35.18

Small or netless copper shapes (teardrops, artwork), in the pictures only: 336 on Top Layer, 50 on Bottom Layer

## Text on the board
Top Layer: 信号 | 上下翻转，右边放排针，下面放蓝牙红外线和雷达，中间放芯片，左边放电源
Top Silkscreen Layer: C6 | + | -
